# EAGLE design DevBoard (EAGLE 9.3.2)
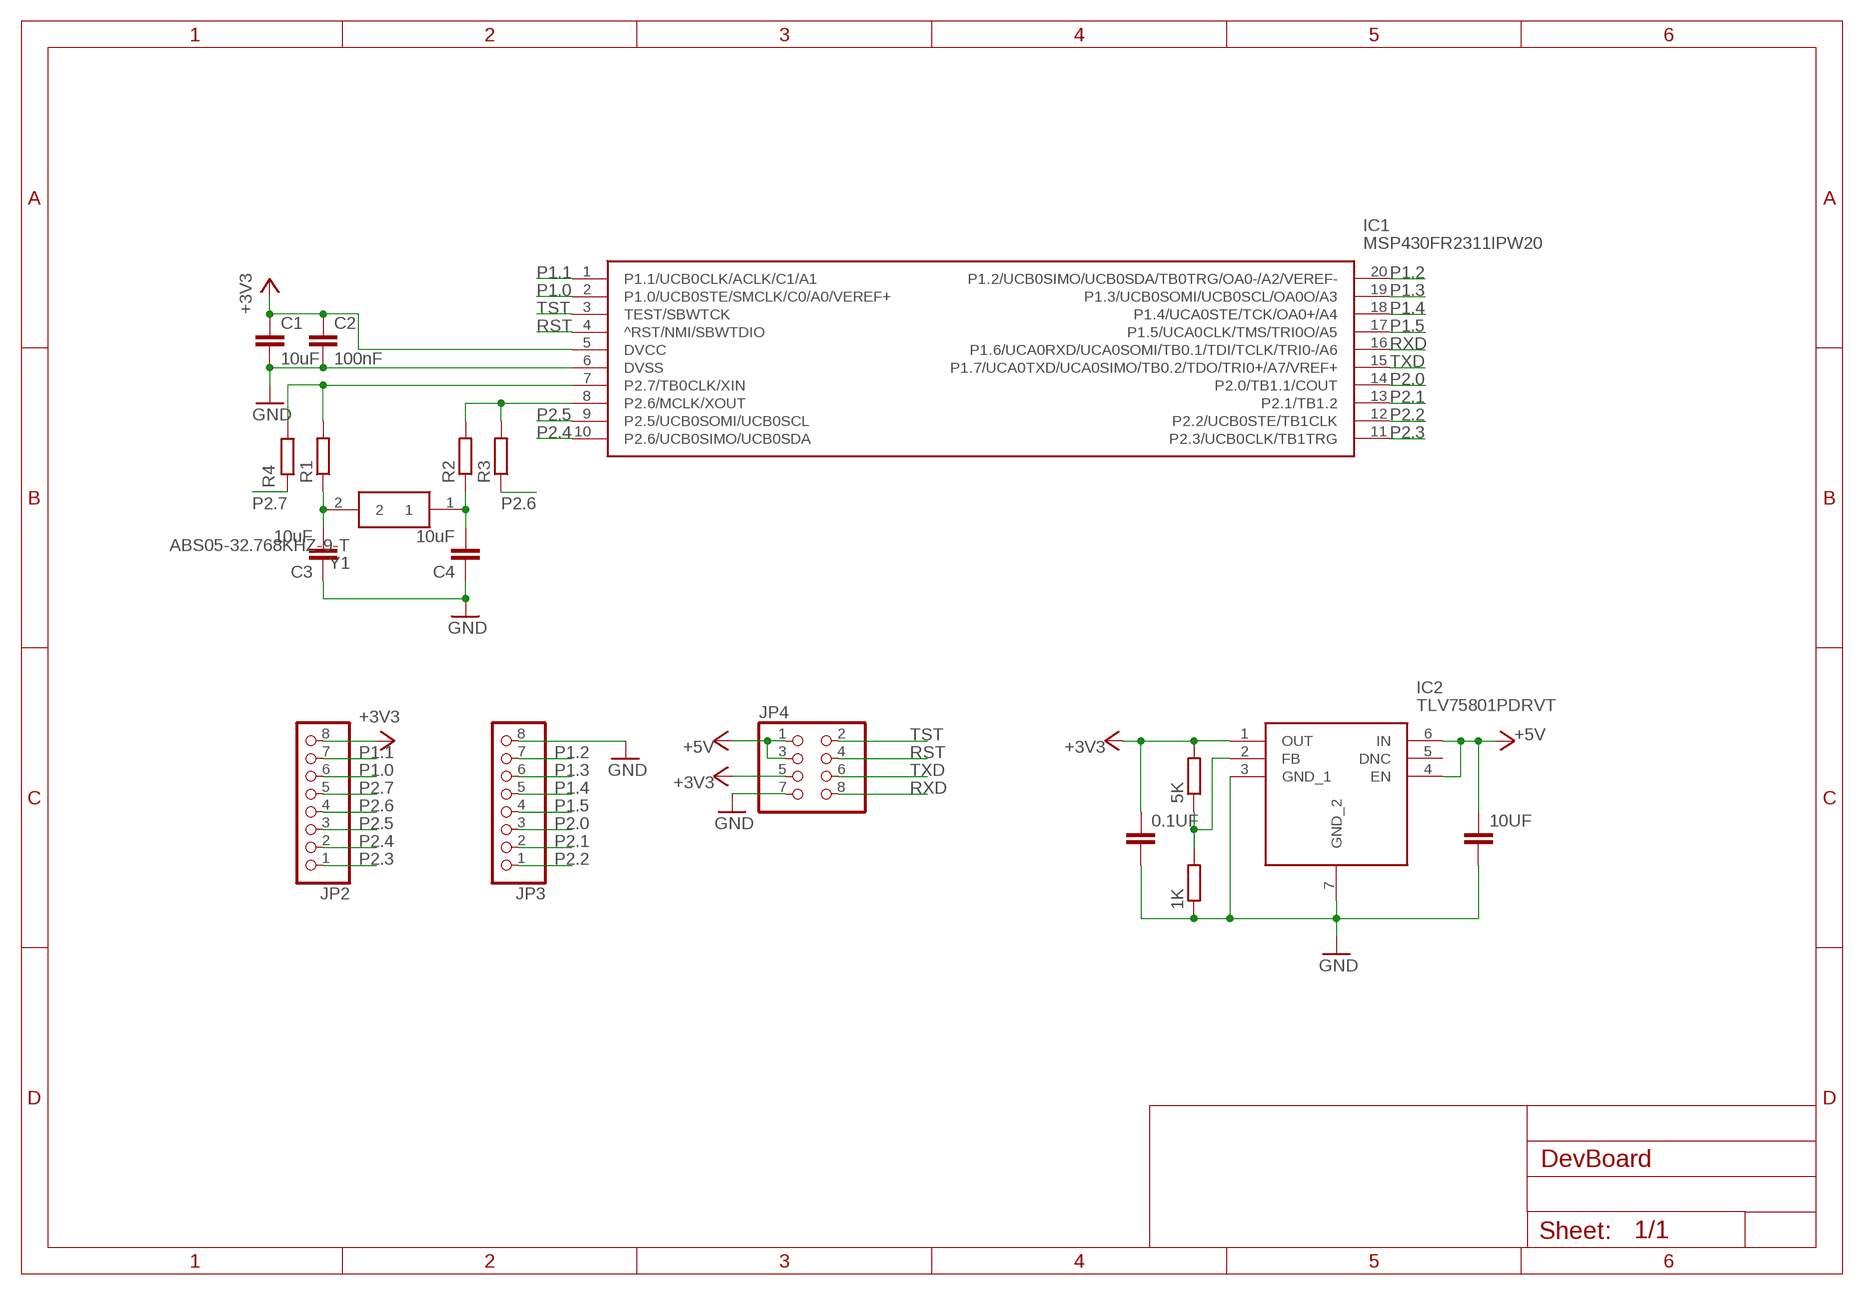
[diagram p0: schematic, sheet 1]

## Parts
0.1UF  C-EUC0805K  [C0805K]
1K  R-EU_R0805  [R0805]
5K  R-EU_R0805  [R0805]
10UF  C-EUC0805K  [C0805K]
C1  10uF  C-EUC0805K  [C0805K]
C2  100nF  C-EUC0805K  [C0805K]
C3  10uF  C-EUC0805K  [C0805K]
C4  10uF  C-EUC0805K  [C0805K]
IC1  MSP430FR2311IPW20  [SOP65P640X120-20N]
IC2  TLV75801PDRVT  [SON65P200X200X80-7N]
JP2  PINHD-1X8  [1X08]
JP3  PINHD-1X8  [1X08]
JP4  PINHD-2X4  [2X04]
R1  R-EU_R0402  [R0402]
R2  R-EU_R0402  [R0402]
R3  R-EU_R0402  [R0402]
R4  R-EU_R0402  [R0402]
Y1  ABS05-32.768KHZ-9-T  [ABS05]

## Nets
+3V3: 0.1UF.1 5K.2 C1.1 C2.1 IC1.5(DVCC) IC2.1(OUT) JP2.8 JP4.5
+5V: 10UF.1 IC2.4(EN) IC2.6(IN) JP4.1 JP4.3
GND: 0.1UF.2 1K.1 10UF.2 C1.2 C2.2 C3.1 C4.1 IC1.6(DVSS) IC2.3(GND_1) IC2.7(GND_2) JP3.8 JP4.7
N$1: C3.2 R1.1 Y1.2
N$2: C4.2 R2.1 Y1.1
N$5: IC1.7(P2.7/TB0CLK/XIN) R1.2 R4.1
N$6: IC1.8(P2.6/MCLK/XOUT) R2.2 R3.2
N$12: 1K.2 5K.1 IC2.2(FB)
P1.0: IC1.2(P1.0/UCB0STE/SMCLK/C0/A0/VEREF+) JP2.6
P1.1: IC1.1(P1.1/UCB0CLK/ACLK/C1/A1) JP2.7
P1.2: IC1.20(P1.2/UCB0SIMO/UCB0SDA/TB0TRG/OA0-/A2/VEREF-) JP3.7
P1.3: IC1.19(P1.3/UCB0SOMI/UCB0SCL/OA0O/A3) JP3.6
P1.4: IC1.18(P1.4/UCA0STE/TCK/OA0+/A4) JP3.5
P1.5: IC1.17(P1.5/UCA0CLK/TMS/TRI0O/A5) JP3.4
P2.0: IC1.14(P2.0/TB1.1/COUT) JP3.3
P2.1: IC1.13(P2.1/TB1.2) JP3.2
P2.2: IC1.12(P2.2/UCB0STE/TB1CLK) JP3.1
P2.3: IC1.11(P2.3/UCB0CLK/TB1TRG) JP2.1
P2.4: IC1.10(P2.6/UCB0SIMO/UCB0SDA) JP2.2
P2.5: IC1.9(P2.5/UCB0SOMI/UCB0SCL) JP2.3
P2.6: JP2.4 R3.1
P2.7: JP2.5 R4.2
RST: IC1.4(^RST/NMI/SBWTDIO) JP4.4
RXD: IC1.16(P1.6/UCA0RXD/UCA0SOMI/TB0.1/TDI/TCLK/TRI0-/A6) JP4.8
TST: IC1.3(TEST/SBWTCK) JP4.2
TXD: IC1.15(P1.7/UCA0TXD/UCA0SIMO/TB0.2/TDO/TRI0+/A7/VREF+) JP4.6
Unconnected: IC2.5(DNC)

## Library data of the parts
0.1UF 10UF C1-C4 = rcl:C-EU: CAPACITOR, European symbol; SPICEPREFIX: C
1K 5K R1-R4 = rcl:R-EU_: RESISTOR, European symbol; SPICEPREFIX: R
IC1 = MSP430FR2311IPW20:MSP430FR2311IPW20: 16-bit Microcontrollers - MCU 16 MHz Ultra-low-power microcontroller with 4 KB FRAM, 1 KB SRAM, 12 IO, 8 ch ADC10, OpAmps, TIA 20-TSSOP -40 to 85 Source: Datasheet <http://www.ti.com/lit/ds/slase58b/slase58b.pdf>; DESCRIPTION: 16-bit Microcontrollers - MCU 16 MHz Ultra-low-power microcontroller with 4 KB FRAM, 1 KB SRAM, 12 IO, 8 ch ADC10, OpAmps, TIA 20-TSSOP -40 to 85; HEIGHT: 1.2mm; MANUFACTURER_NAME: Texas Instruments; MANUFACTURER_PART_NUMBER: MSP430FR2311IPW20; MOUSER_PART_NUMBER: 595-SP430FR2311IPW20; MOUSER_PRICE-STOCK: https://www.mouser.com/Search/Refine.aspx?Keyword=595-SP430FR2311IPW20
IC2 = TLV75801PDRVT:TLV75801PDRVT: LDO Voltage Regulators 500MA LDO WITHOUT PG Source: Datasheet <http://www.ti.com/lit/ds/symlink/tlv758p.pdf>; DESCRIPTION: LDO Voltage Regulators 500MA LDO WITHOUT PG; HEIGHT: 0.8mm; MANUFACTURER_NAME: Texas Instruments; MANUFACTURER_PART_NUMBER: TLV75801PDRVT; MOUSER_PART_NUMBER: 595-TLV75801PDRVT; MOUSER_PRICE-STOCK: https://www.mouser.com/Search/Refine.aspx?Keyword=595-TLV75801PDRVT
JP2 JP3 = pinhead:PINHD-1X8: PIN HEADER
JP4 = pinhead:PINHD-2X4: PIN HEADER
Y1 = ABS05-32.768KHZ-9-T:ABS05-32.768KHZ-9-T: Crystals 32.768KHz 9.0pF 20ppm -40C +85C Source: Datasheet <http://www.abracon.com/Resonators/ABS05.pdf>; DESCRIPTION: Crystals 32.768KHz 9.0pF 20ppm -40C +85C; HEIGHT: mm; MANUFACTURER_NAME: ABRACON; MANUFACTURER_PART_NUMBER: ABS05-32.768KHZ-9-T; MOUSER_PART_NUMBER: 815-ABS05-32.768K9T; MOUSER_PRICE-STOCK: https://www.mouser.com/Search/Refine.aspx?Keyword=815-ABS05-32.768K9T; RS_PART_NUMBER: 815-ABS05-32.768K9T; RS_PRICE-STOCK: https://www.mouser.com/Search/Refine.aspx?Keyword=815-ABS05-32.768K9T

## Board
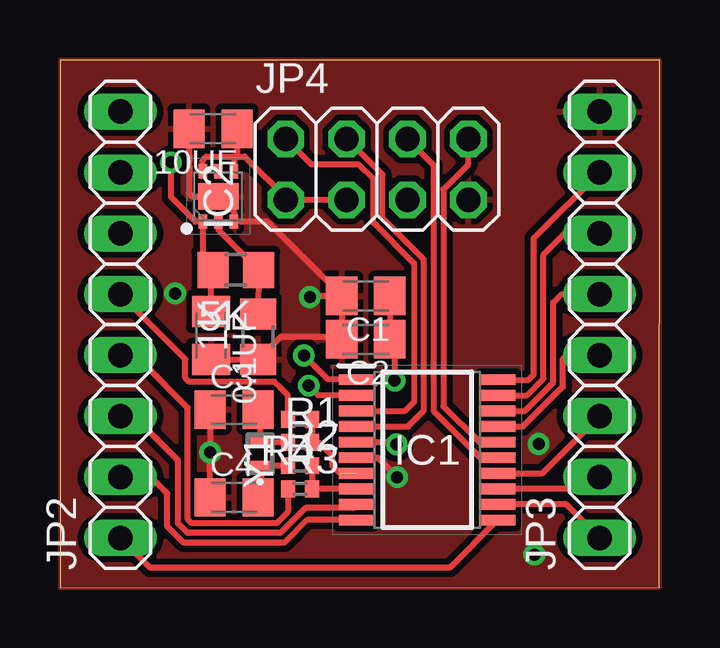
[diagram p1: board, top side]
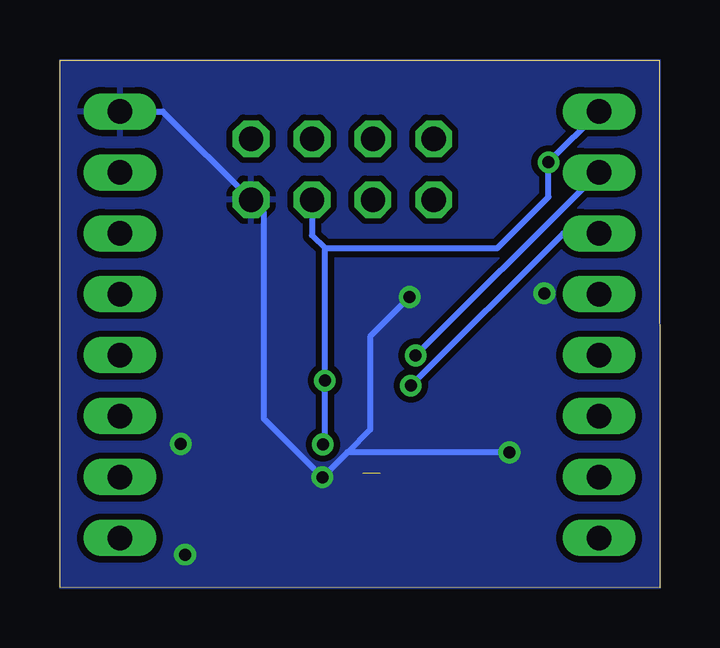
[diagram p2: board, bottom side, seen from below]

Size 25 x 22.02 mm. Coordinates in mm from the lower left corner, seen from the top.
Outline: 0,0 24.99,0.03 25,22.02 0.01,22 0,0
Copper layers (1*16): Top 0.035mm / dielectric 1.5mm / Bottom 0.035mm
Design rules "default *": minimum track width 6mil, minimum drill 0.35mm, track to track 6mil, track to pad 6mil, pad to pad 6mil, via to via 6mil, smd to smd 5mil, copper to edge 0mil, drill to drill 6mil, minimum pad ring 10mil, minimum via ring 8mil, stop-mask expansion 4mil, vias tented up to drill 0mil, thermal gap 10mil

### Footprints (pad centres in the part's own frame; a part is rotated, then mirrored left to right if it is on the bottom)
C0805K = smd 1.3 x 1.6: 1 -1,0; 2 1,0
R0805 = smd 1.3 x 1.5: 1 -0.95,0; 2 0.95,0
SOP65P640X120-20N = smd 1.475 x 0.45: 1 -2.938,2.925; 2 -2.938,2.275; 3 -2.938,1.625; 4 -2.938,0.975; 5 -2.938,0.325; 6 -2.938,-0.325; 7 -2.938,-0.975; 8 -2.938,-1.625; 9 -2.938,-2.275; 10 -2.938,-2.925; 11 2.938,-2.925; 12 2.938,-2.275; 13 2.938,-1.625; 14 2.938,-0.975; 15 2.938,-0.325; 16 2.938,0.325; 17 2.938,0.975; 18 2.938,1.625; 19 2.938,2.275; 20 2.938,2.925
SON65P200X200X80-7N = smd 0.6 x 0.35: 1 -1.05,0.65; 2 -1.05,0; 3 -1.05,-0.65; 4 1.05,-0.65; 5 1.05,0; 6 1.05,0.65 | smd 1.1 x 1.7: 7 0,0
1X08 = drill 1.016 long: 1 -8.89,0; 2 -6.35,0; 3 -3.81,0; 4 -1.27,0; 5 1.27,0; 6 3.81,0; 7 6.35,0; 8 8.89,0
2X04 = drill 1.016 octagon: 1 -3.81,-1.27; 2 -3.81,1.27; 3 -1.27,-1.27; 4 -1.27,1.27; 5 1.27,-1.27; 6 1.27,1.27; 7 3.81,-1.27; 8 3.81,1.27
R0402 = smd 0.6 x 0.7: 1 -0.5,0; 2 0.5,0
ABS05 = smd 0.5 x 1: 1 -0.55,0; 2 0.55,0

### Placement (x,y rotation side)
0.1UF  6.3,10.53 270 top
1K  8.26,10.48 90 top
5K  7.33,13.27 180 top
10UF  6.38,19.15 180 top
C1  12.75,12.18 180 top
C2  12.75,10.37 180 top
C3  7.26,7.44 0 top
C4  7.26,3.78 0 top
IC1  15.31,5.76 0 top
IC2  6.6,16.33 90 top
JP2  2.52,10.98 90 top
JP3  22.5,10.98 90 top
JP4  13.22,17.46 0 top
R1  10.01,6.07 0 top
R2  10.01,5.1 0 top
R3  10.01,4.13 0 top
R4  10.01,7.03 180 top
U$1  [METRIC_15]  0.01,11 0 top
U$2  [METRIC_15]  0,0 180 bottom
U$3  [METRIC_15]  0,0 90 top
U$4  [METRIC_15]  0.01,22 0 top
U$5  [METRIC_15]  23.5,0.01 90 bottom
U$7  [METRIC_15]  2.49,0.01 90 top
U$8  [METRIC_15]  12,0.01 90 top
U$9  [METRIC_15]  -0.01,1.36 0 top
Y1  8.35,5.6 90 top

### Tracks (layer width: path | path; a pad name or v marks a point on that pad's centre or on a via)
+3V3  (via drill 0.5)
  Top 0.254: IC1.5 13.95,6.08 v14.04,5.99 | 6.31,13.35 5.95,13.7 IC2.1 5.65,15.28 4.63,16.3 v4.63,17.75 | 6.31,13.35 5K.2 | v13.96,8.65 13.96,10.16 C2.1 C1.1 | 0.1UF.1 6.31,13.35
  Bottom 0.254: v14.04,5.99 13.96,6.07 v13.96,8.65 13.96,14.17 | 13.96,14.17 6.77,14.17 4.63,16.31 v4.63,17.75 2.52,19.86 JP2.8 | JP4.5 14.49,14.7 13.96,14.17
+5V
  Top 0.254: JP4.1 9.5,16.19 | 9.5,16.19 JP4.3 | IC2.6 5.95,17.84 6.1,17.99 7.18,17.99 | 7.18,17.99 7.25,17.92 IC2.4 | 10UF.1 7.38,18.02 7.35,17.99 | 7.18,17.99 7.35,17.99 | 7.35,17.99 7.7,17.99 9.5,16.19
GND  (via drill 0.5)
  Top 0.254: C3.1 v6.26,5.66 C4.1 | IC1.6 13.26,5.44 v14.06,4.63 v14.06,4.62 | 10UF.2 5.38,16.46 5.52,16.32 5.53,16.33 IC2.7 7.25,15.68 IC2.3 8.65,15.28 C1.2 | C1.2 11.75,10.48 | 11.75,10.48 C2.2 | C1.2 10.47,12.18 v10.42,12.13 | 0.1UF.2 1K.1 9.21,10.48 11.75,10.48
  Bottom 0.254: 13.02,5.66 v14.06,4.62 16.5,7.06 16.5,15.66 JP4.7 20.71,19.87 JP3.8 | 13.02,5.66 12.07,6.61 12.07,10.48 v10.42,12.13 | v6.26,5.66 13.02,5.66
  other vias: 19.78,1.39 19.96,6.01 4.8,12.29
  pour Bottom (isolate 0.254): 0,22 24.98,22 24.98,0 0,0
  pour Top (isolate 0.254): 0,22 0,0.03 25,0.03 25,22.01 -0.01,22.01
N$1
  Top 0.254: R1.1 8.43,6.07 Y1.2 8.35,7.35 C3.2
N$2
  Top 0.254: R2.1 8.4,5.1 | 8.4,5.1 Y1.1 | C4.2 8.4,3.92 8.4,5.1
N$5  (1 unrouted)
  Top 0.254: R4.1 R1.2 | R1.2 10.52,6.08 | 11.66,4.79 11.36,5.09 11.36,5.5 10.79,6.07 R1.2
N$6
  Top 0.254: R2.2 R3.2 IC1.8
N$12
  Top 0.254: IC2.2 6.6,14.95 5K.1 1K.2
P1.0  (via drill 0.5)
  Top 0.254: IC1.2 10.78,8.04 v10.37,8.44
  Bottom 0.254: v10.37,8.44 4.02,14.79 JP2.6
P1.1  (via drill 0.5)
  Top 0.254: IC1.1 12.36,8.7 11.17,8.7 v10.17,9.7
  Bottom 0.254: v10.17,9.7 3.02,16.85 3,16.85 JP2.7
P1.2
  Top 0.254: IC1.20 19.54,8.69 19.76,8.91 19.76,14.59 JP3.7
P1.3
  Top 0.254: IC1.19 19.46,8.04 20.16,8.74 20.16,13.92 21.04,14.79 JP3.6
P1.4
  Top 0.254: IC1.18 19.38,7.38 20.57,8.57 20.57,11.91 20.91,12.25 JP3.5
P1.5
  Top 0.254: IC1.17 19.31,6.74 20.98,8.4 20.98,9.56 21.14,9.72 21.15,9.71 JP3.4
P2.0
  Top 0.254: IC1.14 20.11,4.79 JP3.3
P2.1
  Top 0.254: JP3.2 22,4.13 IC1.13
P2.2
  Top 0.254: JP3.1 21.1,3.49 IC1.12
P2.3
  Top 0.254: JP2.1 3.77,0.84 16.26,0.84 IC1.11
P2.4
  Top 0.254: IC1.10 10.31,2.84 9.36,1.89 5.16,1.89 4.48,2.57 4.48,3.94 3.79,4.63 JP2.2
P2.5
  Top 0.254: IC1.9 12.23,3.34 10.24,3.34 9.19,2.29 5.33,2.29 4.92,2.7 4.92,5.32 3.4,6.84 2.85,6.84 JP2.3
P2.6
  Top 0.254: 9.51,4.03 R3.1 9.51,3.19 9.03,2.7 5.49,2.7 5.33,2.86 5.33,7.52 3.49,9.36 2.87,9.36 JP2.4
P2.7
  Top 0.254: R4.2 9.51,8.03 9.19,8.35 9.19,8.36 8.95,8.6 5.38,8.6 5.22,8.76 5.22,9.55 JP2.5
RST
  Top 0.254: IC1.4 14.52,6.74 15.18,7.4 15.18,13.7 13.45,15.43 13.45,17.23 JP4.4
RXD
  Top 0.254: JP4.8 17.03,17.66 15.99,16.62 15.99,7.58 17.48,6.09 IC1.16
TST
  Top 0.254: IC1.3 14.39,7.38 14.77,7.76 14.77,13.53 13.04,15.26 13.04,17.06 12.44,17.67 10.47,17.67 JP4.2
TXD
  Top 0.254: JP4.6 15.58,17.64 15.58,7.39 17.54,5.44 IC1.15